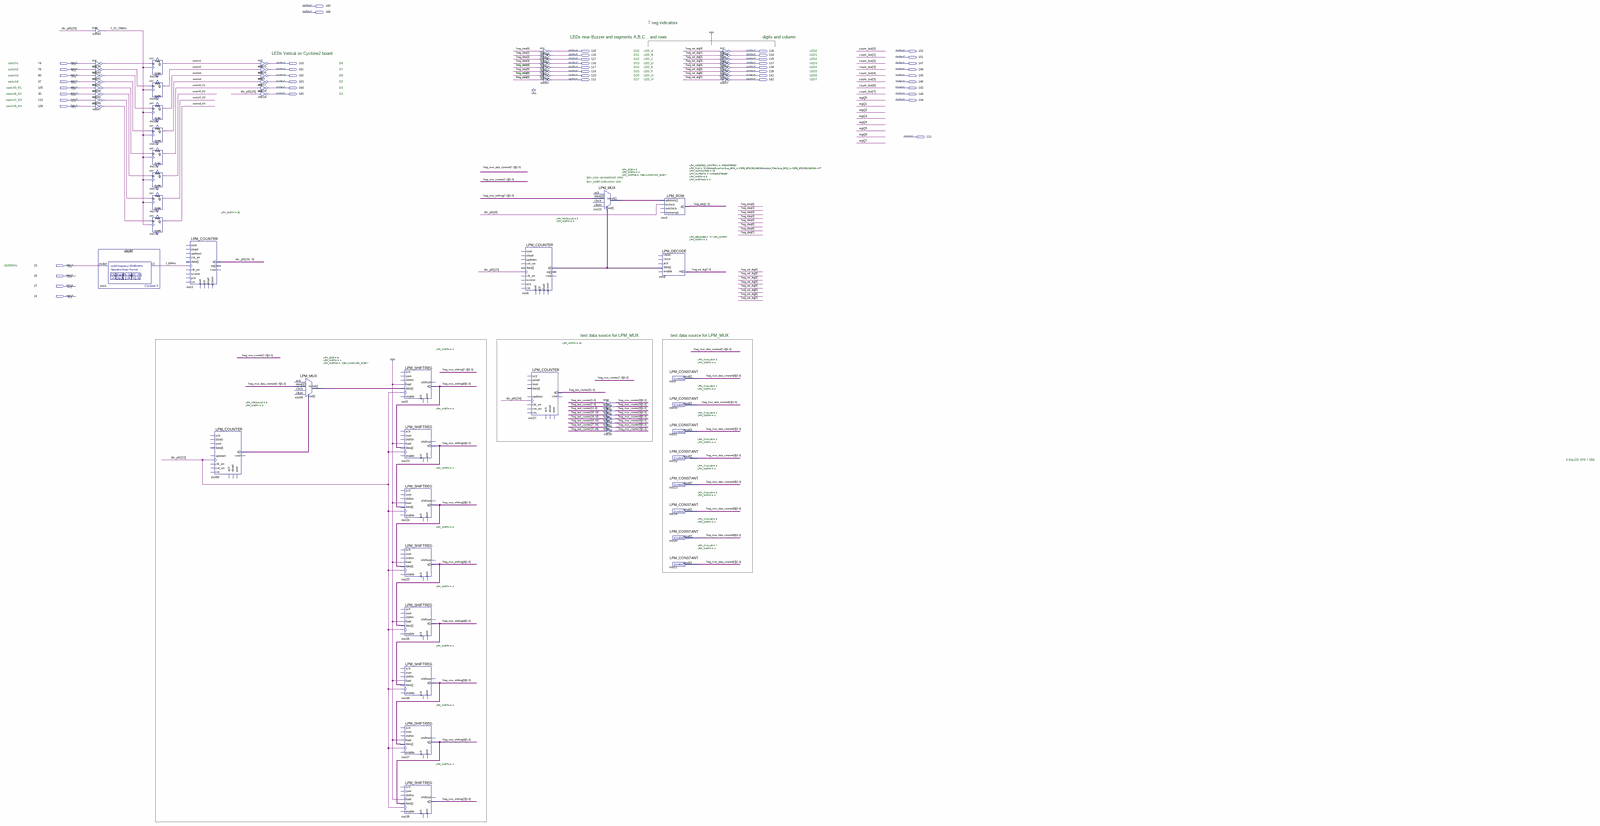
[diagram p0: schematic sheet, whole]
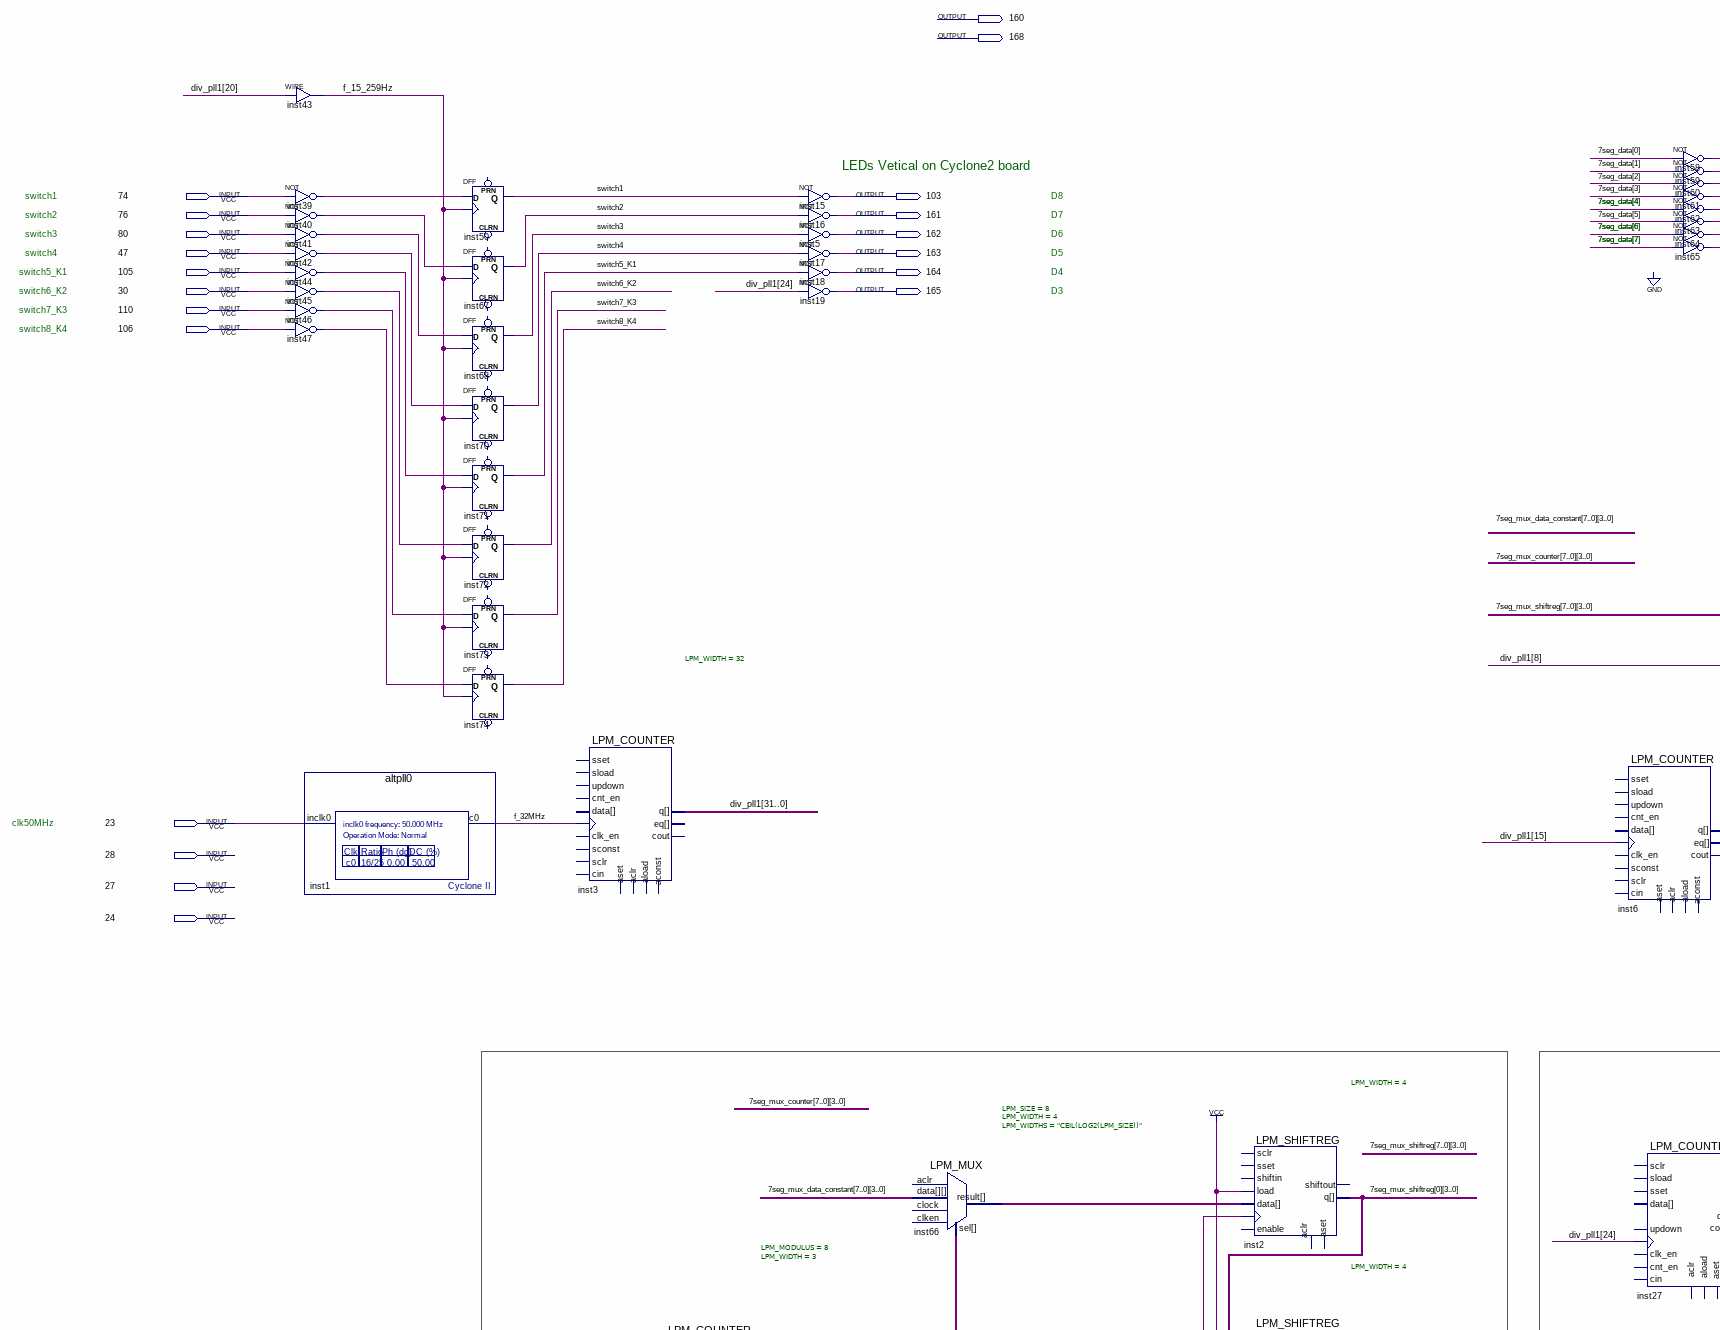
[diagram p1: schematic sheet, upper left part]
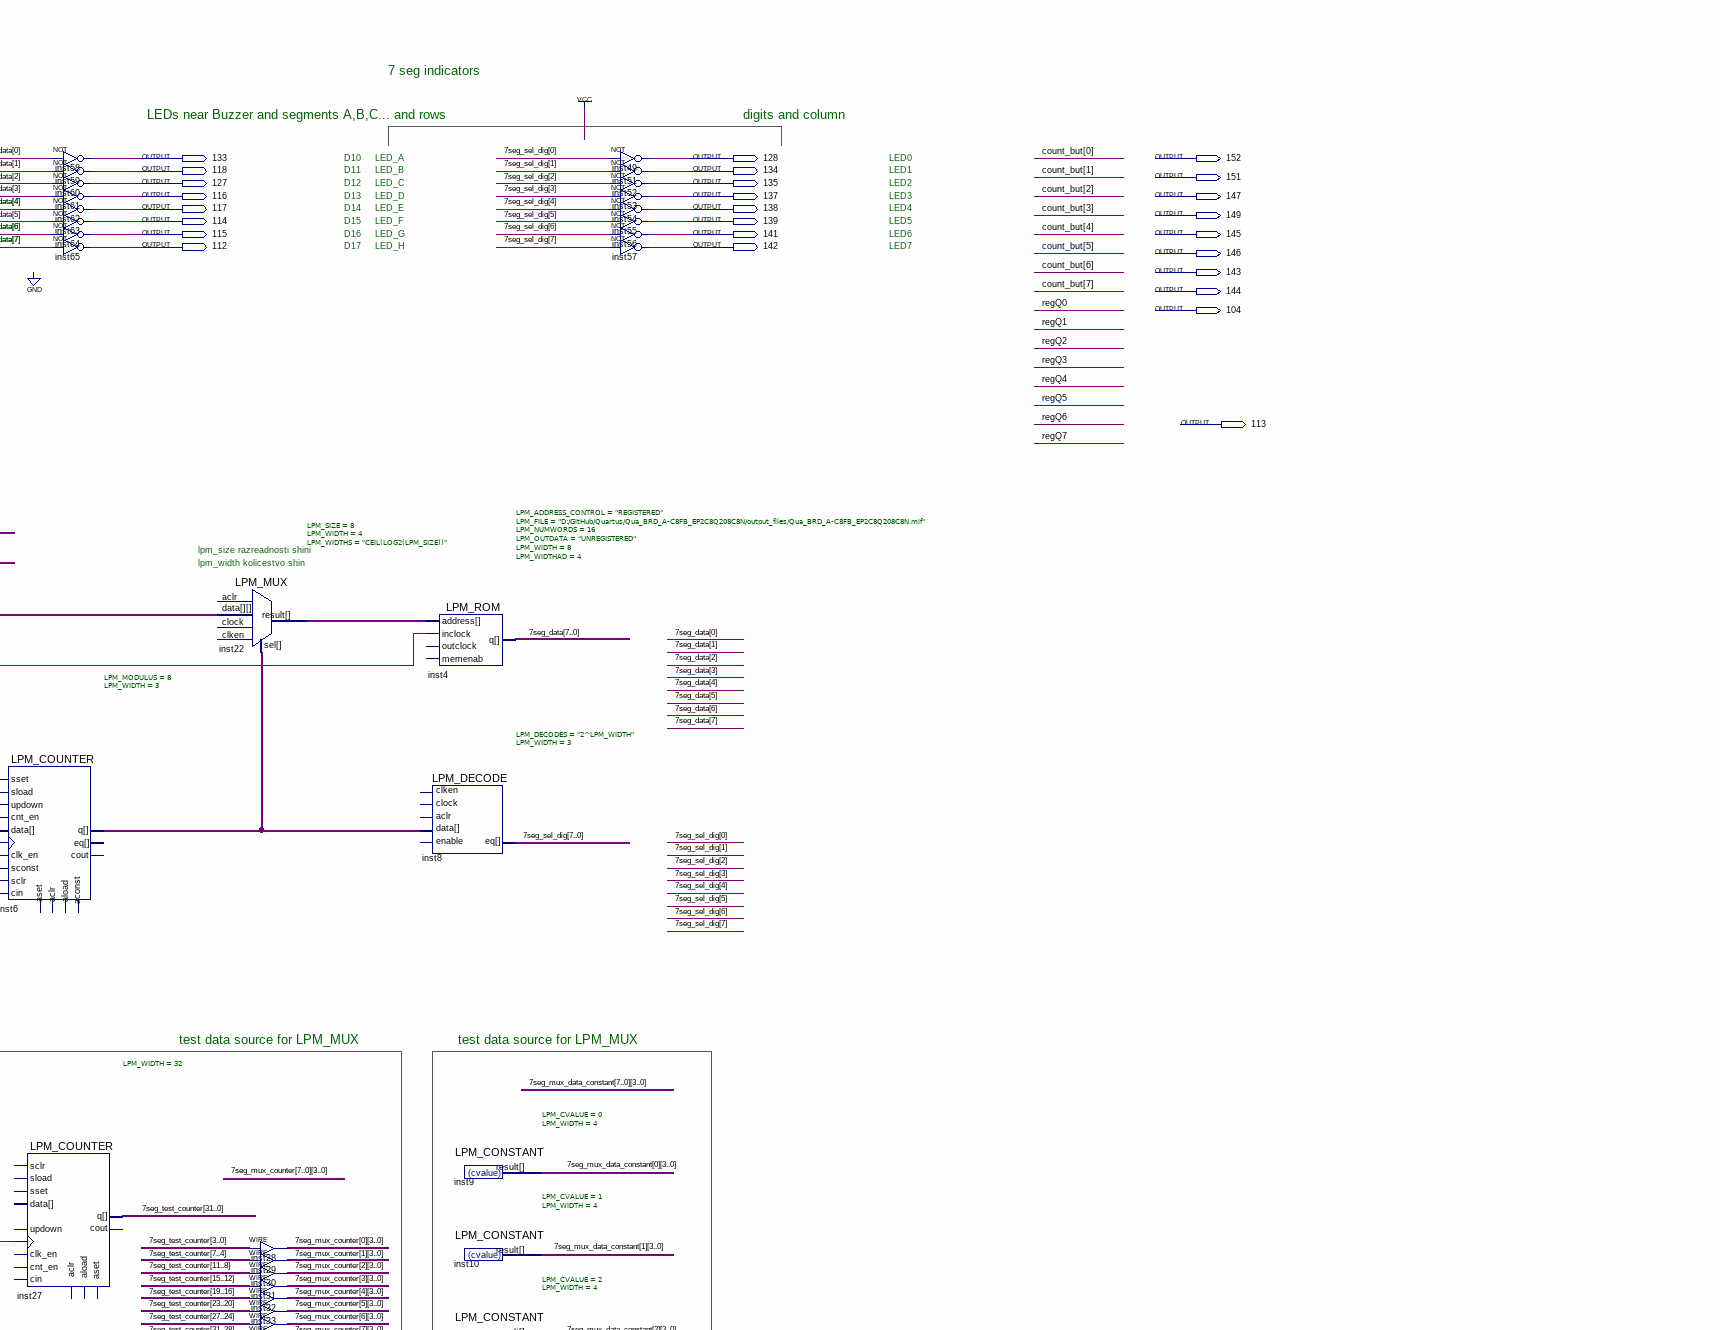
[diagram p2: schematic sheet, upper centre part]
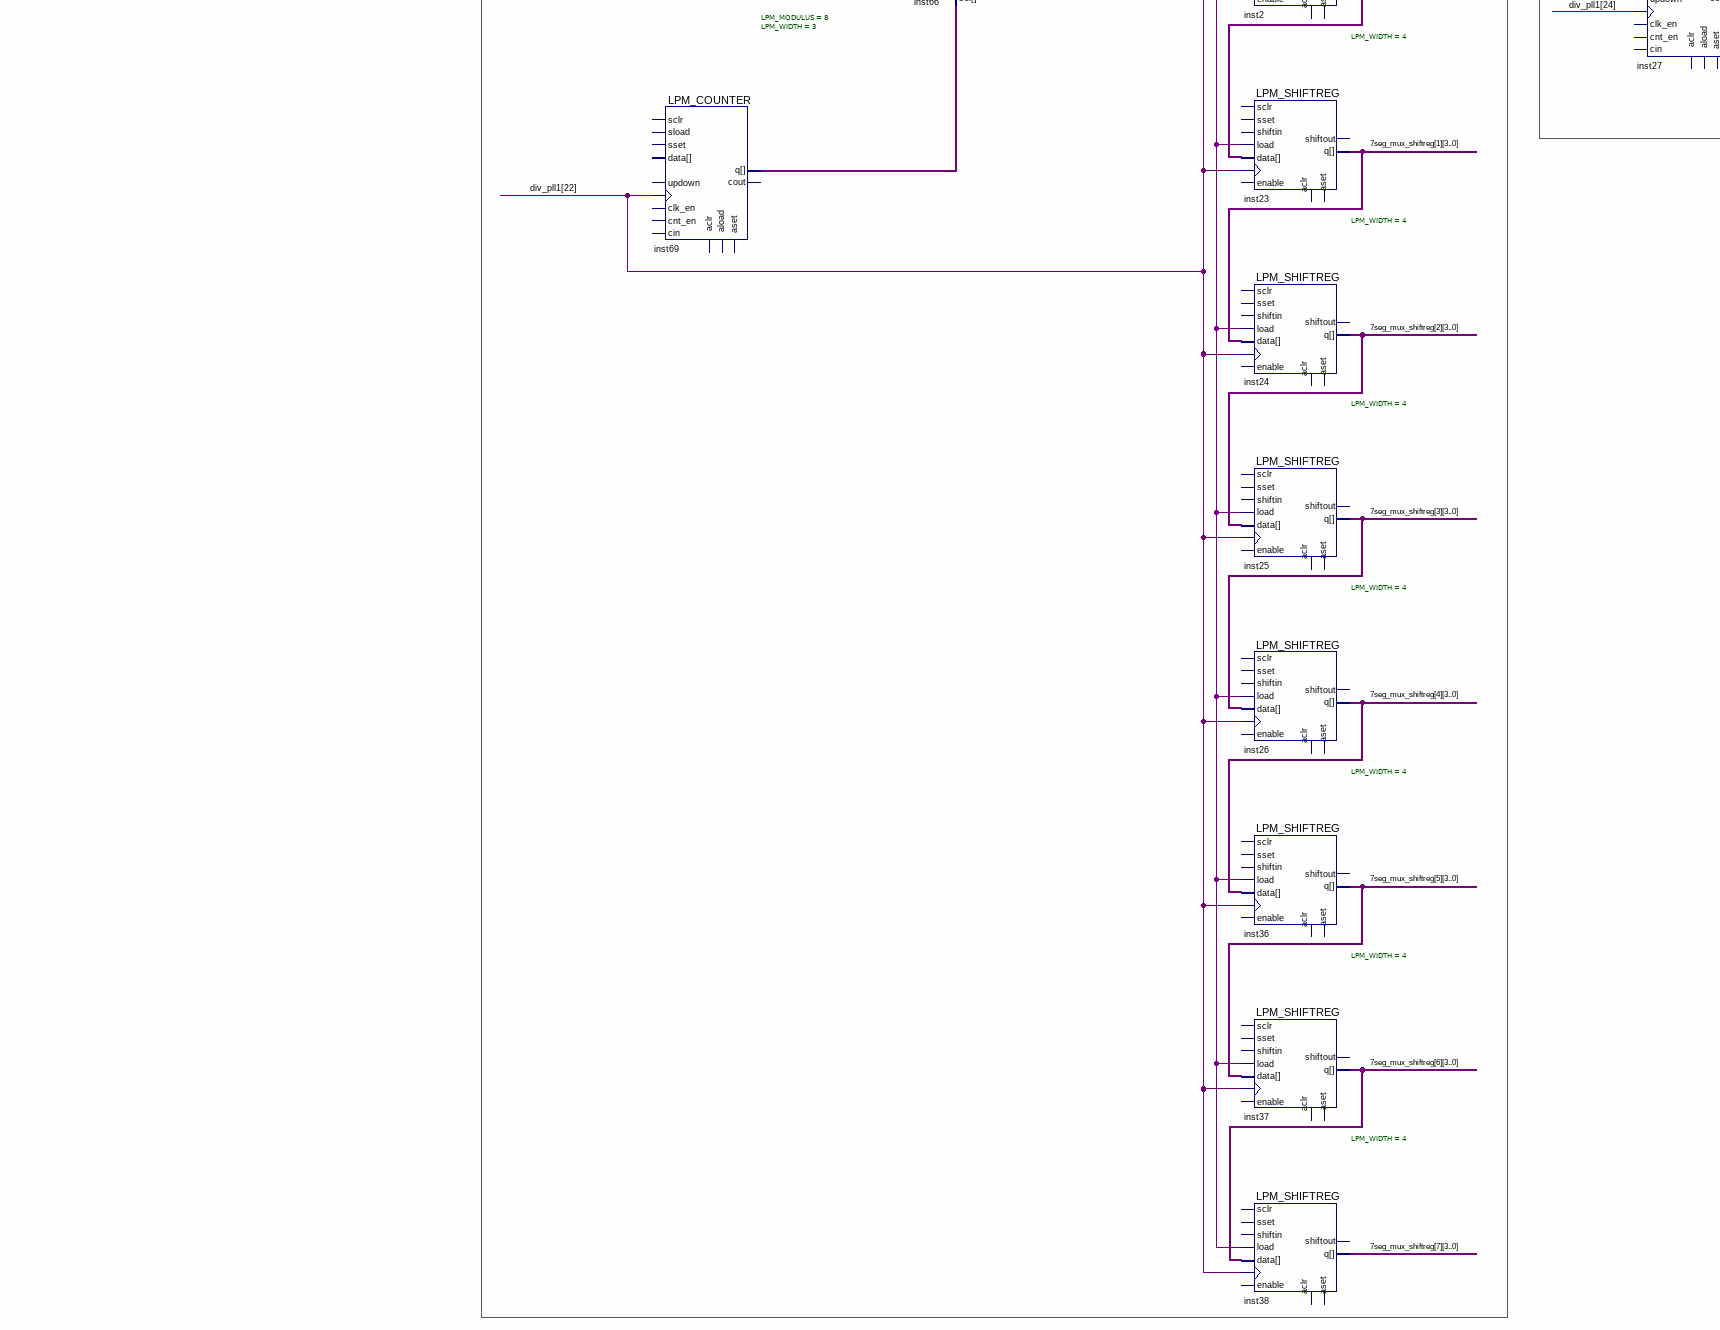
[diagram p3: schematic sheet, lower left part]
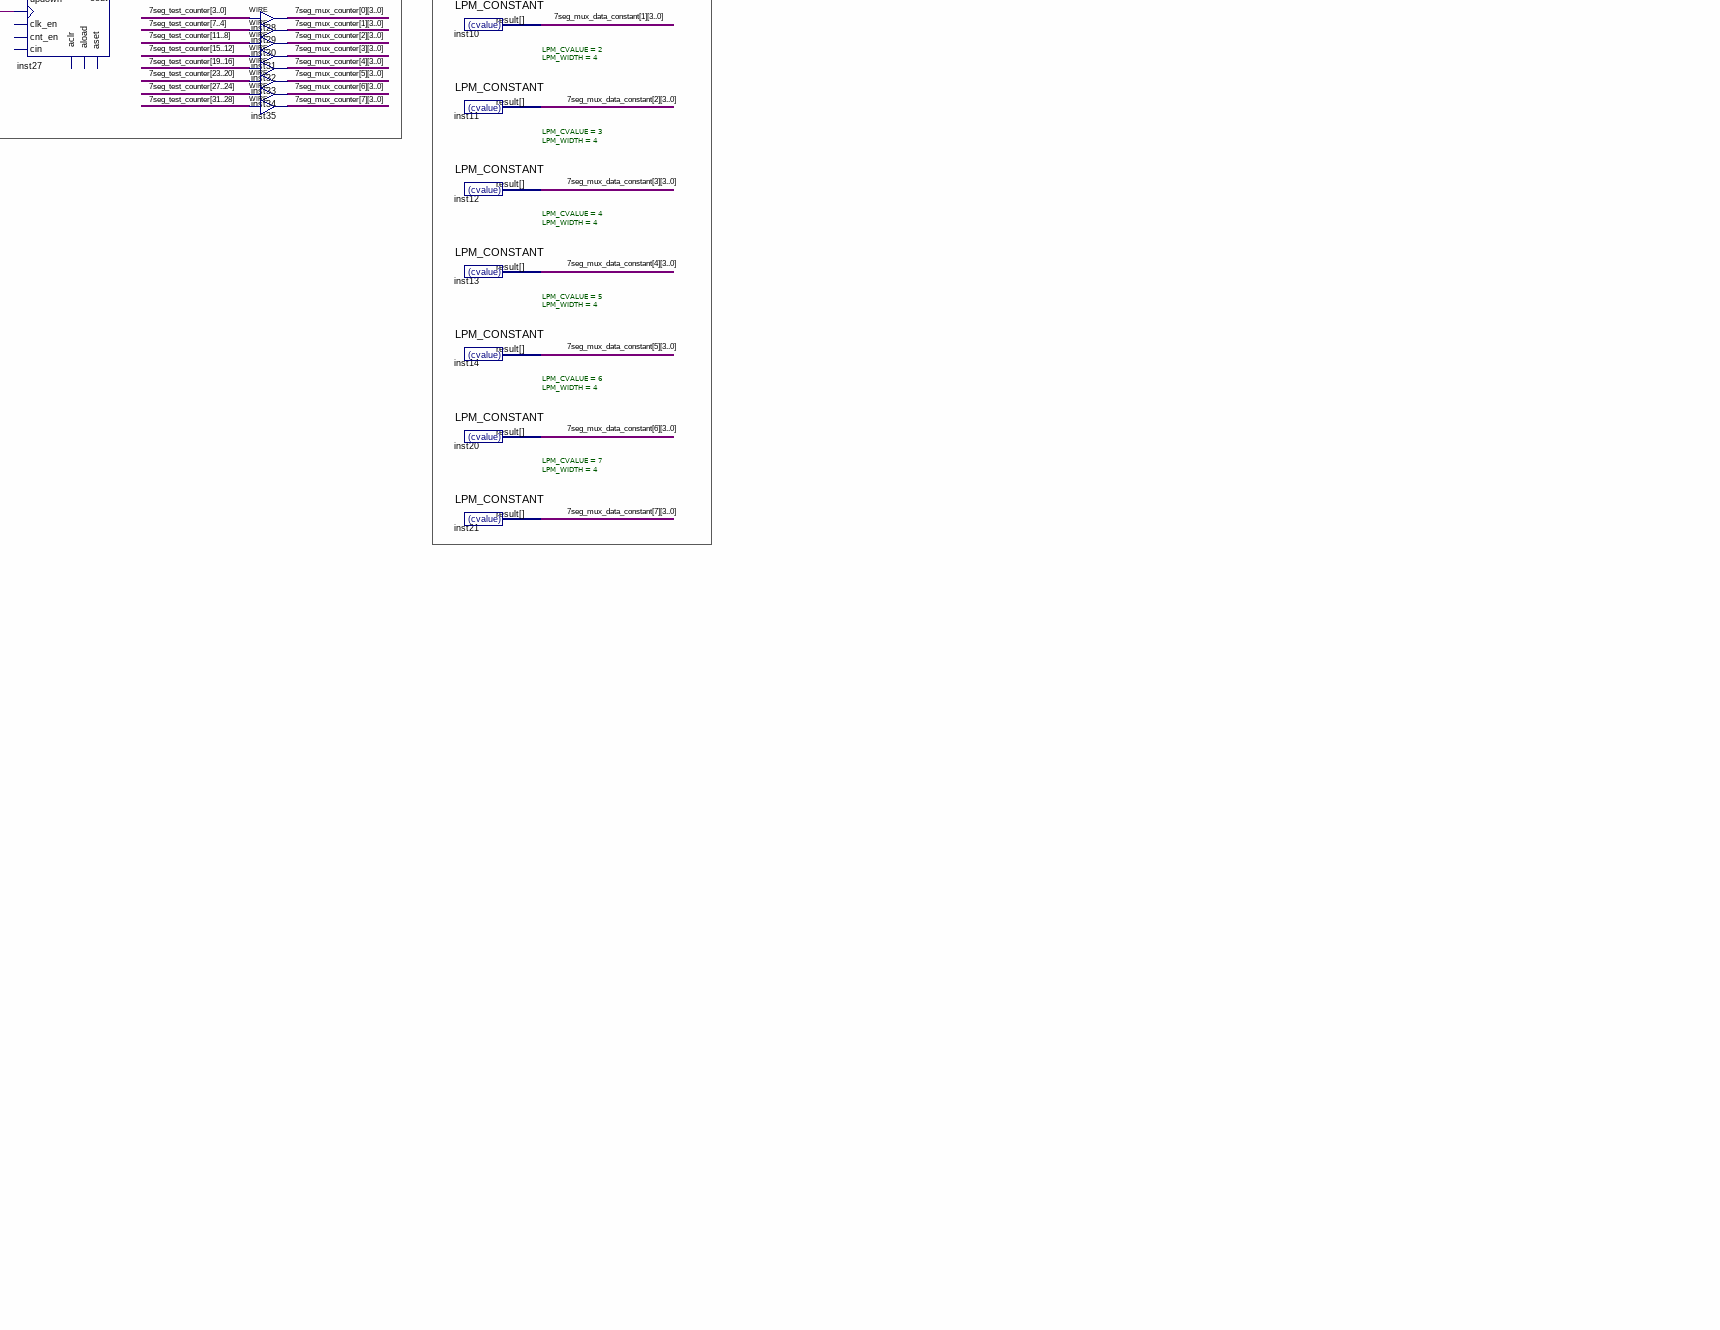
[diagram p4: schematic sheet, lower centre part]
// Quartus schematic Qua_BRD_A-C8FB_EP2C8Q208C8N.bdf as structural Verilog: 72 symbols, 46 pins
module \Qua_BRD_A-C8FB_EP2C8Q208C8N  (
  input  \74 ,
  input  \76 ,
  input  \80 ,
  input  \47 ,
  input  \105 ,
  input  \30 ,
  input  \110 ,
  input  \106 ,
  input  \23 ,
  input  \28 ,
  input  \27 ,
  input  \24 ,
  output \160 ,
  output \168 ,
  output \133 ,
  output \128 ,
  output \152 ,
  output \118 ,
  output \134 ,
  output \151 ,
  output \127 ,
  output \135 ,
  output \103 ,
  output \116 ,
  output \137 ,
  output \147 ,
  output \117 ,
  output \138 ,
  output \161 ,
  output \149 ,
  output \114 ,
  output \139 ,
  output \162 ,
  output \115 ,
  output \141 ,
  output \145 ,
  output \112 ,
  output \142 ,
  output \163 ,
  output \146 ,
  output \164 ,
  output \143 ,
  output \165 ,
  output \144 ,
  output \104 ,
  output \113 
);

  wire f_15_259Hz, f_32MHz, inst39_out, inst40_out, inst41_out, inst42_out, inst44_out, inst45_out,
       inst46_out, inst47_out, switch1, switch2, switch3, switch4, switch5_K1, switch6_K2, switch7_K3,
       switch8_K4;
  wire [2:0] inst6_q, inst69_q;
  wire [3:0] \7seg_mux_counter_0 , \7seg_mux_counter_1 , \7seg_mux_counter_2 , \7seg_mux_counter_3 ,
       \7seg_mux_counter_4 , \7seg_mux_counter_5 , \7seg_mux_counter_6 , \7seg_mux_counter_7 ,
       \7seg_mux_data_constant_0 , \7seg_mux_data_constant_1 , \7seg_mux_data_constant_2 ,
       \7seg_mux_data_constant_3 , \7seg_mux_data_constant_4 , \7seg_mux_data_constant_5 ,
       \7seg_mux_data_constant_6 , \7seg_mux_data_constant_7 , \7seg_mux_shiftreg_0 , \7seg_mux_shiftreg_1 ,
       \7seg_mux_shiftreg_2 , \7seg_mux_shiftreg_3 , \7seg_mux_shiftreg_4 , \7seg_mux_shiftreg_5 ,
       \7seg_mux_shiftreg_6 , \7seg_mux_shiftreg_7 , inst22_result, inst66_result;
  wire [7:0] \7seg_data , \7seg_sel_dig ;
  wire [31:0] \7seg_test_counter , div_pll1;

  assign f_15_259Hz = div_pll1[20];  // WIRE inst43
  not inst39 (inst39_out, \74 );
  not inst40 (inst40_out, \76 );
  not inst41 (inst41_out, \80 );
  not inst42 (inst42_out, \47 );
  not inst44 (inst44_out, \105 );
  not inst45 (inst45_out, \30 );
  not inst46 (inst46_out, \110 );
  not inst47 (inst47_out, \106 );
  altpll0 inst1 (.inclk0(\23 ), .c0(f_32MHz));
  DFF inst50 (.CLK(f_15_259Hz), .D(inst39_out), .Q(switch1));  // open: CLRN, PRN
  DFF inst67 (.CLK(f_15_259Hz), .D(inst40_out), .Q(switch2));  // open: CLRN, PRN
  DFF inst68 (.CLK(f_15_259Hz), .D(inst41_out), .Q(switch3));  // open: CLRN, PRN
  DFF inst70 (.CLK(f_15_259Hz), .D(inst42_out), .Q(switch4));  // open: CLRN, PRN
  DFF inst71 (.CLK(f_15_259Hz), .D(inst44_out), .Q(switch5_K1));  // open: CLRN, PRN
  DFF inst72 (.CLK(f_15_259Hz), .D(inst45_out), .Q(switch6_K2));  // open: CLRN, PRN
  DFF inst73 (.CLK(f_15_259Hz), .D(inst46_out), .Q(switch7_K3));  // open: CLRN, PRN
  DFF inst74 (.CLK(f_15_259Hz), .D(inst47_out), .Q(switch8_K4));  // open: CLRN, PRN
  LPM_COUNTER #(.LPM_WIDTH(32)) inst3 (
    .clock(f_32MHz), .q(div_pll1));  // open: sset, sload, updown, cnt_en, data, clk_en, sconst, sclr, aload, aclr, aset, aconst, cin, eq, cout
  LPM_COUNTER #(.LPM_MODULUS(8), .LPM_WIDTH(3)) inst69 (
    .clock(div_pll1[22]), .q(inst69_q));  // open: sload, data, clk_en, aload, aclr, aset, cin, sset, updown, cnt_en, sclr, cout
  not inst15 (\103 , switch1);
  not inst16 (\161 , switch2);
  not inst5 (\162 , switch3);
  not inst17 (\163 , switch4);
  not inst18 (\164 , switch5_K1);
  not inst19 (\165 , div_pll1[24]);
  LPM_MUX #(.LPM_SIZE(8), .LPM_WIDTH(4), .LPM_WIDTHS("CEIL(LOG2(LPM_SIZE))")) inst66 (
    .data({\7seg_mux_data_constant_7 , \7seg_mux_data_constant_6 , \7seg_mux_data_constant_5 , \7seg_mux_data_constant_4 , \7seg_mux_data_constant_3 , \7seg_mux_data_constant_2 , \7seg_mux_data_constant_1 , \7seg_mux_data_constant_0 }),
    .sel(inst69_q), .result(inst66_result));  // open: clock, aclr, clken
  LPM_SHIFTREG #(.LPM_WIDTH(4)) inst2 (
    .clock(div_pll1[22]), .data(inst66_result), .load(1'b1), .q(\7seg_mux_shiftreg_0 ));  // open: shiftin, sset, enable, sclr, aset, aclr, shiftout
  LPM_SHIFTREG #(.LPM_WIDTH(4)) inst23 (
    .clock(div_pll1[22]), .data(\7seg_mux_shiftreg_0 ), .load(1'b1), .q(\7seg_mux_shiftreg_1 ));  // open: shiftin, sset, enable, sclr, aset, aclr, shiftout
  LPM_SHIFTREG #(.LPM_WIDTH(4)) inst24 (
    .clock(div_pll1[22]), .data(\7seg_mux_shiftreg_1 ), .load(1'b1), .q(\7seg_mux_shiftreg_2 ));  // open: shiftin, sset, enable, sclr, aset, aclr, shiftout
  LPM_SHIFTREG #(.LPM_WIDTH(4)) inst25 (
    .clock(div_pll1[22]), .data(\7seg_mux_shiftreg_2 ), .load(1'b1), .q(\7seg_mux_shiftreg_3 ));  // open: shiftin, sset, enable, sclr, aset, aclr, shiftout
  LPM_SHIFTREG #(.LPM_WIDTH(4)) inst26 (
    .clock(div_pll1[22]), .data(\7seg_mux_shiftreg_3 ), .load(1'b1), .q(\7seg_mux_shiftreg_4 ));  // open: shiftin, sset, enable, sclr, aset, aclr, shiftout
  LPM_SHIFTREG #(.LPM_WIDTH(4)) inst36 (
    .clock(div_pll1[22]), .data(\7seg_mux_shiftreg_4 ), .load(1'b1), .q(\7seg_mux_shiftreg_5 ));  // open: shiftin, sset, enable, sclr, aset, aclr, shiftout
  LPM_SHIFTREG #(.LPM_WIDTH(4)) inst37 (
    .clock(div_pll1[22]), .data(\7seg_mux_shiftreg_5 ), .load(1'b1), .q(\7seg_mux_shiftreg_6 ));  // open: shiftin, sset, enable, sclr, aset, aclr, shiftout
  LPM_SHIFTREG #(.LPM_WIDTH(4)) inst38 (
    .clock(div_pll1[22]), .data(\7seg_mux_shiftreg_6 ), .load(1'b1), .q(\7seg_mux_shiftreg_7 ));  // open: shiftin, sset, enable, sclr, aset, aclr, shiftout
  LPM_COUNTER #(.LPM_MODULUS(8), .LPM_WIDTH(3)) inst6 (
    .clock(div_pll1[15]), .q(inst6_q));  // open: sset, sload, updown, cnt_en, data, clk_en, sconst, sclr, aload, aclr, aset, aconst, cin, eq, cout
  LPM_COUNTER #(.LPM_WIDTH(32)) inst27 (
    .clock(div_pll1[24]), .q(\7seg_test_counter ));  // open: sload, data, clk_en, aload, aclr, aset, cin, sset, updown, cnt_en, sclr, cout
  not inst58 (\133 , \7seg_data [0]);
  not inst59 (\118 , \7seg_data [1]);
  not inst60 (\127 , \7seg_data [2]);
  not inst61 (\116 , \7seg_data [3]);
  not inst62 (\117 , \7seg_data [4]);
  not inst63 (\114 , \7seg_data [5]);
  not inst64 (\115 , \7seg_data [6]);
  not inst65 (\112 , \7seg_data [7]);
  LPM_MUX #(.LPM_SIZE(8), .LPM_WIDTH(4), .LPM_WIDTHS("CEIL(LOG2(LPM_SIZE))")) inst22 (
    .data({\7seg_mux_shiftreg_7 , \7seg_mux_shiftreg_6 , \7seg_mux_shiftreg_5 , \7seg_mux_shiftreg_4 , \7seg_mux_shiftreg_3 , \7seg_mux_shiftreg_2 , \7seg_mux_shiftreg_1 , \7seg_mux_shiftreg_0 }),
    .sel(inst6_q), .result(inst22_result));  // open: clock, aclr, clken
  assign \7seg_mux_counter_0  = \7seg_test_counter [3:0];  // WIRE inst28
  assign \7seg_mux_counter_1  = \7seg_test_counter [7:4];  // WIRE inst29
  assign \7seg_mux_counter_2  = \7seg_test_counter [11:8];  // WIRE inst30
  assign \7seg_mux_counter_3  = \7seg_test_counter [15:12];  // WIRE inst31
  assign \7seg_mux_counter_4  = \7seg_test_counter [19:16];  // WIRE inst32
  assign \7seg_mux_counter_5  = \7seg_test_counter [23:20];  // WIRE inst33
  assign \7seg_mux_counter_6  = \7seg_test_counter [27:24];  // WIRE inst34
  assign \7seg_mux_counter_7  = \7seg_test_counter [31:28];  // WIRE inst35
  LPM_ROM #(.LPM_ADDRESS_CONTROL("REGISTERED"), .LPM_FILE("D:/GitHub/Quartus/Qua_BRD_A-C8FB_EP2C8Q208C8N/output_files/Qua_BRD_A-C8FB_EP2C8Q208C8N.mif"), .LPM_NUMWORDS(16), .LPM_OUTDATA("UNREGISTERED"), .LPM_WIDTH(8), .LPM_WIDTHAD(4)) inst4 (
    .address(inst22_result), .inclock(div_pll1[8]), .q(\7seg_data ));  // open: outclock, memenab
  LPM_DECODE #(.LPM_DECODES("2^LPM_WIDTH"), .LPM_WIDTH(3)) inst8 (
    .data(inst6_q), .eq(\7seg_sel_dig ));  // open: enable, clken, clock, aclr
  LPM_CONSTANT #(.LPM_CVALUE(0), .LPM_WIDTH(4)) inst9 (.result(\7seg_mux_data_constant_0 ));
  LPM_CONSTANT #(.LPM_CVALUE(1), .LPM_WIDTH(4)) inst10 (.result(\7seg_mux_data_constant_1 ));
  LPM_CONSTANT #(.LPM_CVALUE(2), .LPM_WIDTH(4)) inst11 (.result(\7seg_mux_data_constant_2 ));
  LPM_CONSTANT #(.LPM_CVALUE(3), .LPM_WIDTH(4)) inst12 (.result(\7seg_mux_data_constant_3 ));
  LPM_CONSTANT #(.LPM_CVALUE(4), .LPM_WIDTH(4)) inst13 (.result(\7seg_mux_data_constant_4 ));
  LPM_CONSTANT #(.LPM_CVALUE(5), .LPM_WIDTH(4)) inst14 (.result(\7seg_mux_data_constant_5 ));
  LPM_CONSTANT #(.LPM_CVALUE(6), .LPM_WIDTH(4)) inst20 (.result(\7seg_mux_data_constant_6 ));
  LPM_CONSTANT #(.LPM_CVALUE(7), .LPM_WIDTH(4)) inst21 (.result(\7seg_mux_data_constant_7 ));
  not inst49 (\128 , \7seg_sel_dig [0]);
  not inst51 (\134 , \7seg_sel_dig [1]);
  not inst52 (\135 , \7seg_sel_dig [2]);
  not inst53 (\137 , \7seg_sel_dig [3]);
  not inst54 (\138 , \7seg_sel_dig [4]);
  not inst55 (\139 , \7seg_sel_dig [5]);
  not inst56 (\141 , \7seg_sel_dig [6]);
  not inst57 (\142 , \7seg_sel_dig [7]);

  // Notes on the sheet:
  //   7 seg indicators
  //   LEDs near Buzzer and segments A,B,C... and rows
  //   digits and column
  //   D10
  //   LED_A
  //   LED0
  //   LEDs Vetical on Cyclone2 board
  //   D11
  //   LED_B
  //   LED1
  //   D12
  //   LED_C
  //   LED2
  //   switch1
  //   D8
  //   D13
  //   LED_D
  //   LED3
  //   7seg_data[4]
  //   D14
  //   LED_E
  //   LED4
  //   switch2
  //   D7
  //   D15
  //   LED_F
  //   LED5
  //   7seg_data[6]
  //   switch3
  //   D6
  //   D16
  //   LED_G
  //   LED6
  //   7seg_data[7]
  //   D17
  //   LED_H
  //   LED7
  //   switch4
  //   D5
  //   switch5_K1
  //   D4
  //   switch6_K2
  //   D3
  //   switch7_K3
  //   switch8_K4
  //   lpm_size razreadnosti shini
  //   lpm_width kolicestvo shin
  //   clk50MHz
  //   test data source for LPM_MUX
  //   test data source for LPM_MUX
  //   ê ÐàçÚåì XP6 7 ñåãì
endmodule
